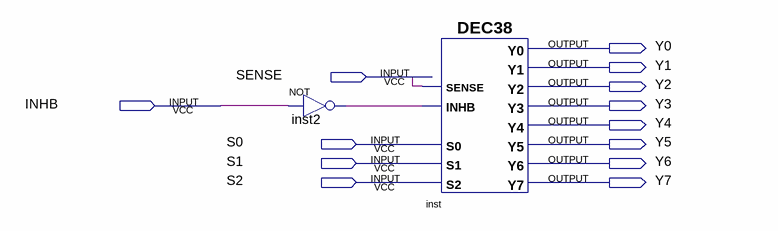
[diagram p0: schematic sheet]
// Quartus schematic dec38_sche.bdf as structural Verilog: 2 symbols, 13 pins
module dec38_sche (
  input  SENSE,
  input  INHB,
  input  S0,
  input  S1,
  input  S2,
  output Y0,
  output Y1,
  output Y2,
  output Y3,
  output Y4,
  output Y5,
  output Y6,
  output Y7
);

  wire inst2_out;

  not inst2 (inst2_out, INHB);
  DEC38 inst (
    .S2(S2), .S1(S1), .INHB(inst2_out), .S0(S0), .SENSE(SENSE), .Y7(Y7), .Y6(Y6), .Y5(Y5), .Y3(Y3), .Y4(Y4),
    .Y0(Y0), .Y1(Y1), .Y2(Y2));
endmodule
